# Altium schematic sheet BOARD_GPIO.SchDoc
size D; SheetNumber: 5; SheetTotal: 5
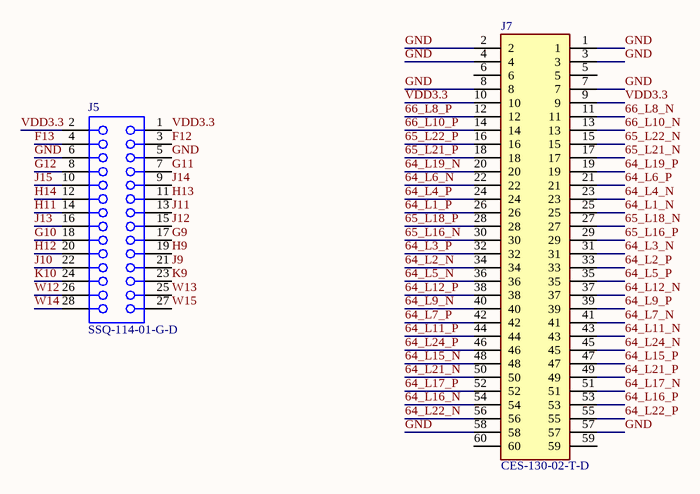
[diagram p0: BOARD_GPIO.SchDoc]

## Parts
J5  SSQ-114-01-G-D  [SMTC-SSQ-114-01-X-D]
J7  CES-130-02-T-D  [CES-130-XX-X-D]

## Nets
64_L1_N: J7.25
64_L1_P: J7.26
64_L2_N: J7.34
64_L2_P: J7.33
64_L3_N: J7.31
64_L3_P: J7.32
64_L4_N: J7.23
64_L4_P: J7.24
64_L5_N: J7.36
64_L5_P: J7.35
64_L6_N: J7.22
64_L6_P: J7.21
64_L7_N: J7.41
64_L7_P: J7.42
64_L9_N: J7.40
64_L9_P: J7.39
64_L11_N: J7.43
64_L11_P: J7.44
64_L12_N: J7.37
64_L12_P: J7.38
64_L15_N: J7.48
64_L15_P: J7.47
64_L16_N: J7.54
64_L16_P: J7.53
64_L17_N: J7.51
64_L17_P: J7.52
64_L19_N: J7.20
64_L19_P: J7.19
64_L21_N: J7.50
64_L21_P: J7.49
64_L22_N: J7.56
64_L22_P: J7.55
64_L24_N: J7.45
64_L24_P: J7.46
65_L16_N: J7.30
65_L16_P: J7.29
65_L18_N: J7.27
65_L18_P: J7.28
65_L21_N: J7.17
65_L21_P: J7.18
65_L22_N: J7.15
65_L22_P: J7.16
66_L8_N: J7.11
66_L8_P: J7.12
66_L10_N: J7.13
66_L10_P: J7.14
F12: J5.3
F13: J5.4
G9: J5.17
G10: J5.18
G11: J5.7
G12: J5.8
GND: J5.5 J5.6 J7.1 J7.2 J7.3 J7.4 J7.7 J7.8 J7.57 J7.58
H9: J5.19
H11: J5.14
H12: J5.20
H13: J5.11
H14: J5.12
J9: J5.21
J10: J5.22
J11: J5.13
J12: J5.15
J13: J5.16
J14: J5.9
J15: J5.10
K9: J5.23
K10: J5.24
VDD3.3: J5.1 J5.2 J7.9 J7.10
W12: J5.26
W13: J5.25
W14: J5.28
W15: J5.27

Not connected (* = marked no-connect by the designer): J7 5 6 59 60

## Library data of the parts
J5 = CMP-1023-00305-1: SQ Post Socket, Through-hole, Vertical, -55 to 125 degC, 2.54 mm Pitch, 28-Pin, Female, RoHS; Manufacturer: Samtec; Pitch: 2.54 mm; Temperature Range: -55 to 125 degC; Mounting Technology: Through-hole; ComponentLink1URL: http://www.samtec.com; PackageDescription: Assembly, Socket Strip .025[0.64] SQ Tail; Orientation: Vertical; RoHS: True; ComponentLink3URL: http://www.samtec.com/documents/webfiles/cpdf/SSQ-1XX-XX-XXX-X-XX-XXX-XX-X-MKT.pdf; ComponentLink2URL: http://www.samtec.com/documents/webfiles/pdf/SSQ_TH.PDF; ComponentLink1Description: Manufacturer URL; PackageReference: SSQ-114-01-X-D; DatasheetVersion: F-214; ComponentLink3Description: Package Specification; ComponentLink2Description: Datasheet; PartNumber: SSQ-114-01-G-D; PackageVersion: BD, 6/1987
J7 = CES-130-02-T-D: Connector; Manufacturer_Name: SAMTEC; Datasheet Link: http://suddendocs.samtec.com/prints/ces-1xx-xx-x-d%20-mkt.pdf; Manufacturer_Part_Number: CES-130-02-T-D